# Altium schematic sheet Controller_page.SchDoc: Blue Pill
size A; DrawnBy: Haris; Engineer: Haris; Revision: v1; SheetNumber: 1; SheetTotal: 2
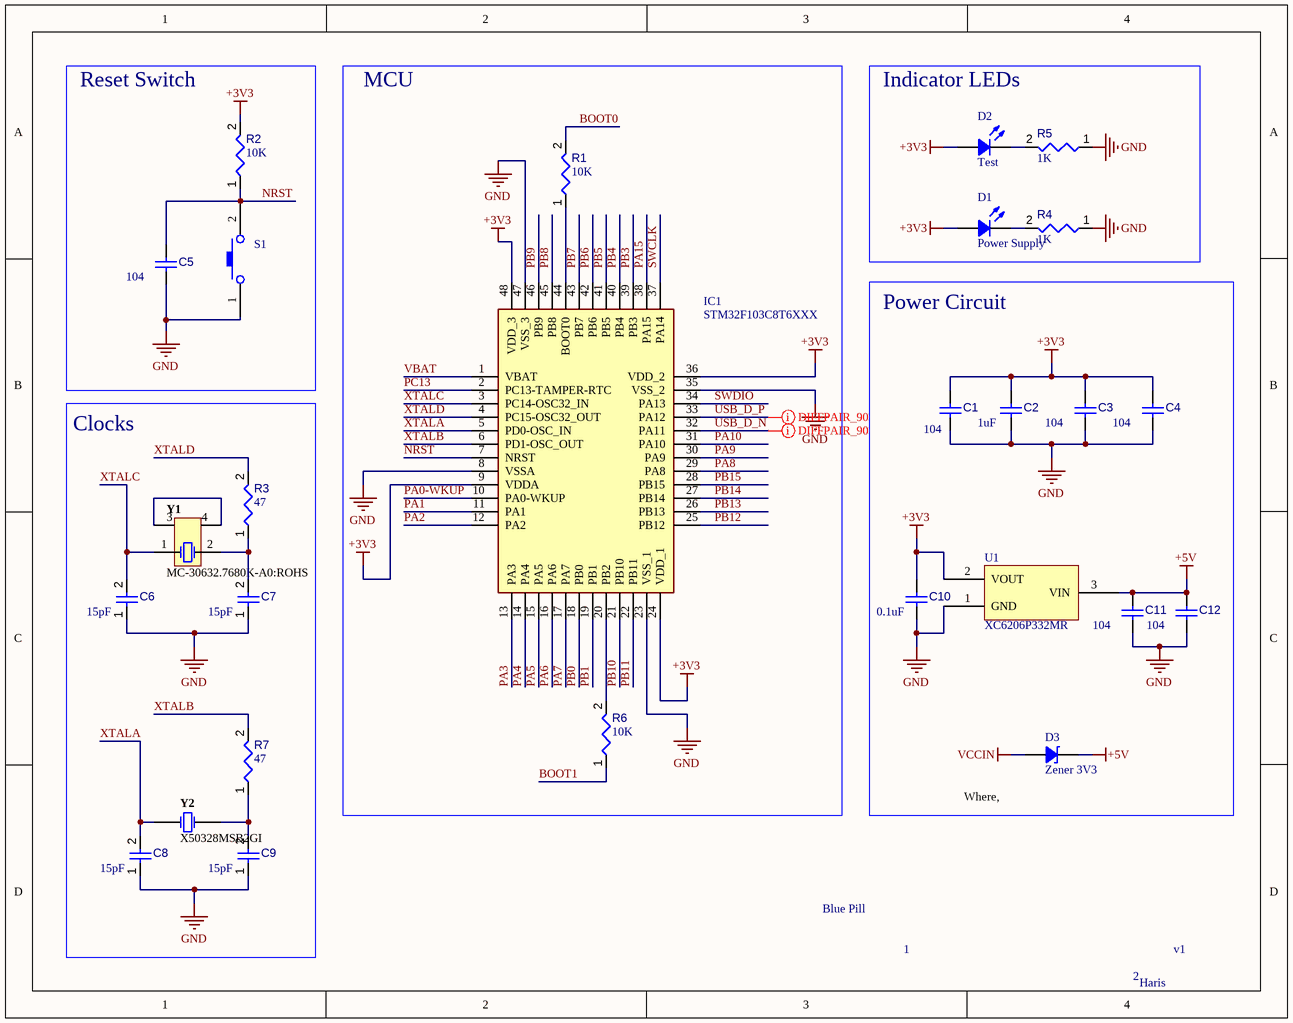
[diagram p0: Controller_page.SchDoc]

## Parts
C1  value 104  [CAPC0805(2012)145_L]  (hidden comment: Capacitor 4.7µF +/-40% 25V 0805)
C2  value 1uF  [CAPC0805(2012)145_L]  (hidden comment: Capacitor 4.7µF +/-40% 25V 0805)
C3  value 104  [CAPC0805(2012)145_L]  (hidden comment: Capacitor 4.7µF +/-40% 25V 0805)
C4  value 104  [CAPC0805(2012)145_L]  (hidden comment: Capacitor 4.7µF +/-40% 25V 0805)
C5  value 104  [CAPC0805(2012)145_L]  (hidden comment: Capacitor 4.7µF +/-40% 25V 0805)
C6  value 15pF  [CAPC0805(2012)145_L]  (hidden comment: Capacitor 4.7µF +/-40% 25V 0805)
C7  value 15pF  [CAPC0805(2012)145_L]  (hidden comment: Capacitor 4.7µF +/-40% 25V 0805)
C8  value 15pF  [CAPC0805(2012)145_L]  (hidden comment: Capacitor 4.7µF +/-40% 25V 0805)
C9  value 15pF  [CAPC0805(2012)145_L]  (hidden comment: Capacitor 4.7µF +/-40% 25V 0805)
C10  value 0.1uF  [CAPC0805(2012)145_L]  (hidden comment: Capacitor 4.7µF +/-40% 25V 0805)
C11  value 104  [CAPC0805(2012)145_L]  (hidden comment: Capacitor 4.7µF +/-40% 25V 0805)
C12  value 104  [CAPC0805(2012)145_L]  (hidden comment: Capacitor 4.7µF +/-40% 25V 0805)
D1  Power Supply  [LED 0805_2012 GREEN]
D2  Test  [LED 0805_2012 RED]
D3  Zener 3V3  [SOD-123]
IC1  STM32F103C8T6XXX  [QFP50P900X900X160-48N]
R1  value 10K  [RESC0805(2012)_L]  (hidden comment: 470R5J)
R2  value 10K  [RESC0805(2012)_L]  (hidden comment: 470R5J)
R3  value 47  [RESC0805(2012)_L]  (hidden comment: 470R5J)
R4  value 1K  [RESC0805(2012)_L]  (hidden comment: 470R5J)
R5  value 1K  [RESC0805(2012)_L]  (hidden comment: 470R5J)
R6  value 10K  [RESC0805(2012)_L]  (hidden comment: 470R5J)
R7  value 47  [RESC0805(2012)_L]  (hidden comment: 470R5J)
S1  TS-1088-AR02016  [TS-1088-AR02016-Footprint-1]  (value not drawn)
U1  XC6206P332MR  [XC6206P332MR-Footprint-1]
Y1  MC-30632.7680K-A0:ROHS  [MC-30632.7680K-A0:ROHS-Footprint-1]
Y2  X50328MSB2GI  [X50328MSB2GI-Footprint-1]

## Blocks framed on the sheet
Reset Switch: C5 R2 S1
MCU: IC1 R1 R6
Indicator LEDs: D1 D2 R4 R5
Power Circuit: C1-C4 C10-C12 D3 U1
Clocks: C6-C9 R3 R7 Y1 Y2

## Nets
+3V3: C1.2 C2.2 C3.2 C4.2 C10.2 D1.1 D2.1 IC1.9(VDDA) IC1.24(VDD_1) IC1.36(VDD_2) IC1.48(VDD_3) R2.2 U1.2(VOUT)
+5V: C11.2 C12.2 D3.2 U1.3(VIN)
GND: C1.1 C2.1 C3.1 C4.1 C5.1 C6.1 C7.1 C8.1 C9.1 C10.1 C11.1 C12.1 IC1.8(VSSA) IC1.23(VSS_1) IC1.35(VSS_2) IC1.47(VSS_3) R4.1 R5.1 S1.1 U1.1(GND)
VCCIN: D3.1
BOOT0: R1.2
BOOT1: R6.1
NRST: C5.2 IC1.7(NRST) R2.1 S1.2
PA0-WKUP: IC1.10(PA0-WKUP)
PA1: IC1.11(PA1)
PA2: IC1.12(PA2)
PA3: IC1.13(PA3)
PA4: IC1.14(PA4)
PA5: IC1.15(PA5)
PA6: IC1.16(PA6)
PA7: IC1.17(PA7)
PA8: IC1.29(PA8)
PA9: IC1.30(PA9)
PA10: IC1.31(PA10)
PA15: IC1.38(PA15)
PB0: IC1.18(PB0)
PB1: IC1.19(PB1)
PB3: IC1.39(PB3)
PB4: IC1.40(PB4)
PB5: IC1.41(PB5)
PB6: IC1.42(PB6)
PB7: IC1.43(PB7)
PB8: IC1.45(PB8)
PB9: IC1.46(PB9)
PB10: IC1.21(PB10)
PB11: IC1.22(PB11)
PB12: IC1.25(PB12)
PB13: IC1.26(PB13)
PB14: IC1.27(PB14)
PB15: IC1.28(PB15)
PC13: IC1.2(PC13-TAMPER-RTC)
SWCLK: IC1.37(PA14)
SWDIO: IC1.34(PA13)
USB_D_N: IC1.32(PA11)
USB_D_P: IC1.33(PA12)
VBAT: IC1.1(VBAT)
XTALA: C8.2 IC1.5(PD0-OSC_IN) Y2.1
XTALB: IC1.6(PD1-OSC_OUT) R7.2
XTALC: C6.2 IC1.3(PC14-OSC32_IN) Y1.1
XTALD: IC1.4(PC15-OSC32_OUT) R3.2
NetC7_2: C7.2 R3.1 Y1.2
NetC9_2: C9.2 R7.1 Y2.2
NetD1_2: D1.2 R4.2
NetD2_2: D2.2 R5.2
NetIC1_20: IC1.20(PB2) R6.2
NetIC1_44: IC1.44(BOOT0) R1.1

Not connected (* = marked no-connect by the designer): Y1 3 4

## Layout directives
differential pair; differential pair class diff_90: USB_D_N, USB_D_P

## Notes on the sheet
- (near D3) Where, @{"Id":"IHHNLVRZ\HNVIZJBW","ObjectType":1} is from the USB.

## Library data of the parts
C1-C5 C10-C12 = CMP-001-00080-4: Chip Capacitor, 4.7µF +/-40%, 25V, 0805, Thickness 1.45 mm; Tolerance: 20%; Voltage Rating: 25V; Min Operating Temperature: -55°C; Max Operating Temperature: 85°C; Pins: 2; Mounting Technology: SMT; Case/Package: 0805
C6-C9 = CMP-001-00080-5: Chip Capacitor, 4.7µF +/-40%, 25V, 0805, Thickness 1.45 mm; Tolerance: 20%; Voltage Rating: 25V; Min Operating Temperature: -55°C; Max Operating Temperature: 85°C; Pins: 2; Mounting Technology: SMT; Case/Package: 0805
D1 = APHCM2012CGCK-F01: LED GREEN CLEAR CHIP SMD; Manufacturer: Kingbright; Configuration: Standard; Current - Test: 20mA; Lens Color: Colorless; Lens Size: 1.30mm x 1.25mm; Lens Style: Rectangle with Flat Top; Millicandela Rating: 50mcd; Viewing Angle: 110°; Voltage - Forward (Vf) (Typ): 2.1V; Wavelength - Dominant: 570nm; Wavelength - Peak: 574nm; Part Number: APHCM2012CGCK-F01; Color: Green; ComponentLink1Description: Datasheet; ComponentLink1URL: http://www.kingbrightusa.com/images/catalog/SPEC/APHCM2012CGCK-F01.pdf; ComponentLink2Description: DigiKey Link; ComponentLink2URL: https://www.digikey.com/en/products/detail/kingbright/APHCM2012CGCK-F01/1747492; Device Package: 0805 (2012 Metric); Height (Max): 0.40mm; LastUpdated: 3/11/2024 7:52:47 AM; Lens Transparency: Clear; Lifecycle Status: Active; Minimum Order: 1; Mounting Type: Surface Mount; Package / Case: 0805 (2012 Metric); Packaging: TapeAndReel; PartId: 241; Part Status: Active; Price: 0.05; Series: -; Size / Dimension: 2.00mm L x 1.25mm W; Supplier 1: DigiKey; Supplier Part Number 1: 754-1094-1-ND; Supplier Device Package: Chip LED; Value: Green
D2 = LTST-C170KAKT: LED RED CLEAR SMD; Manufacturer: Lite-On Inc.; Configuration: Standard; Current - Test: 20mA; Lens Color: Colorless; Lens Size: 1.40mm x 1.25mm; Lens Style: Rectangle with Flat Top; Millicandela Rating: 54mcd; Viewing Angle: 130°; Voltage - Forward (Vf) (Typ): 2V; Wavelength - Dominant: 615nm; Wavelength - Peak: 621nm; Part Number: LTST-C170KAKT; Color: Red; ComponentLink1Description: Datasheet; ComponentLink1URL: http://optoelectronics.liteon.com/upload/download/DS-22-99-0182/LTST-C170KAKT.pdf; ComponentLink2Description: DigiKey Link; ComponentLink2URL: http://digikey.com/product-detail/en/lite-on-inc/LTST-C170KAKT/160-1412-1-ND/386772; Device Package: 0805 (2012 Metric); Height (Max): 1.10mm; LastUpdated: 3/11/2024 7:52:22 AM; Lens Transparency: Clear; Lifecycle Status: Active; Minimum Order: 1; Mounting Type: Surface Mount; Package / Case: 0805 (2012 Metric); Packaging: TapeAndReel; PartId: 305; Part Status: Active; Price: 0.07; Series: -; Size / Dimension: 2.00mm L x 1.25mm W; Supplier 1: DigiKey; Supplier Part Number 1: 160-1412-1-ND; Value: Red
D3 = BZT52C3V3-HE3-18: DIODE ZENER 3.3V 410MW SOD123; Manufacturer: Vishay Semiconductor Diodes Division; Impedance (Max) (Zzt): 80 Ohms; Tolerance: ±5%; Part Number: BZT52C3V3-HE3-18; ComponentLink1Description: Datasheet; ComponentLink1URL: http://www.vishay.com/docs/85760/bzt52.pdf; ComponentLink2Description: DigiKey Link; ComponentLink2URL: http://digikey.com/product-detail/en/vishay-semiconductor-diodes-division/BZT52C3V3-HE3-18/BZT52C3V3-HE3-18GICT-ND/7717359; LastUpdated: 3/11/2024 7:47:45 AM; Lifecycle Status: Active; Minimum Order: 1; Mounting Type: Surface Mount; Operating Temperature: -55°C ~ 150°C; Package / Case: SOD-123; Packaging: TapeAndReel; PartId: 1614; Part Status: Active; Power - Max: 410mW; Price: 0.04; Series: Automotive, AEC-Q101; Supplier 1: DigiKey; Supplier Part Number 1: BZT52C3V3-HE3-18GICT-ND; Supplier Device Package: SOD-123; Voltage - Zener (Nom) (Vz): 3.3V
IC1 = STM32F103C8T6XXX: Integrated Circuit; Manufacturer_Name: ST; Height: 1.6mm; Manufacturer_Part_Number: STM32F103C8T6XXX
R1 R2 R4-R6 = CMP-009-00102-2: 470R 0.125W 5% 0805 (2012 Metric)  SMD; Power: 125mW; Pins: 2; Case/Package: 0805; Mounting Technology: SMT; Tolerance: 5%
R3 R7 = CMP-009-00102-3: 470R 0.125W 5% 0805 (2012 Metric)  SMD; Power: 125mW; Pins: 2; Case/Package: 0805; Mounting Technology: SMT; Tolerance: 5%
S1 = CMP-011-00069-3: NO 50mA 100MΩ 100000 Times 12V 160gf@±50gf Brick nogging SPST SMD Tactile Switches ROHS; Pins: 2; Current Rating: 50mA; Case/Package: SMD; Voltage Rating: 12V; RoHS Compliant: Yes; Throw Configuration: SPST
U1 = CMP-019-00049-3: 200mA Fixed 3.3V Positive 6V SOT-23-3L Linear Voltage Regulators (LDO) ROHS; Dropout Voltage: 680mV; Pins: 3; Output Current: 200mA; Output Voltage: 3.3V; Case/Package: SOT-23-3L
Y1 = CMP-003-00031-7: 32.768 kHz ±20ppm Crystal 12.5pF 50 kOhms 4-SOJ, 5.50mm pitch; ESR: 50k; Min Operating Temperature: -40°C; Load Capacitance: 12.5pF; Frequency: 32.768kHz; Case/Package: 4-SOJ 5.50mm pitch; Max Operating Temperature: 85°C; Mounting Technology: PARALLEL - FUNDAMENTAL; RoHS Compliant: Yes; Pins: 4
Y2 = CMP-003-00032-3: 8MHz 20pF ±10ppm SMD5032-2P Crystals ROHS; ESR: 80; Min Operating Temperature: -40°C; RoHS Compliant: Yes; Max Operating Temperature: 125°C; Frequency: 8MHz; Load Capacitance: 20pF; Mounting Technology: SMD; Pins: 2; Case/Package: SMD5032-2P